# Altium schematic sheet Title-Page.SchDoc
size A4; SheetNumber: 1; SheetTotal: 9
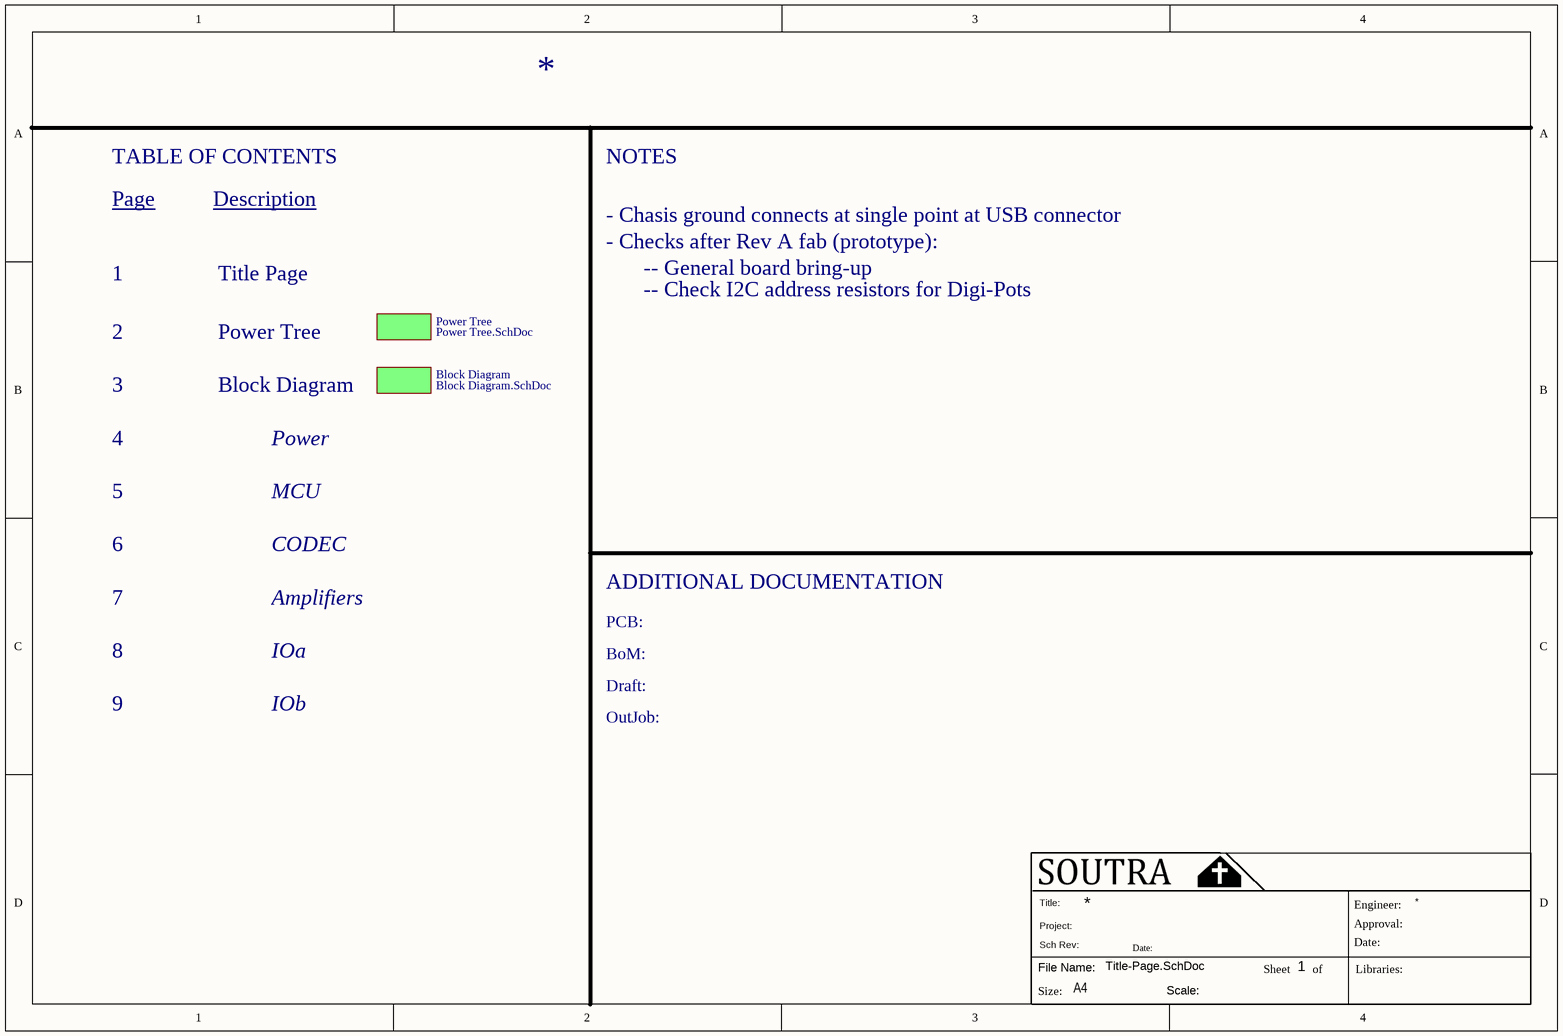
[diagram p0: Title-Page.SchDoc]

## Sub-sheets
Block Diagram = Block Diagram.SchDoc: no entries
Power Tree = Power Tree.SchDoc: no entries

## Notes on the sheet
- TABLE OF CONTENTS
- NOTES
- Page
- Description
- - Chasis ground connects at single point at USB connector
- 1
- Title Page
- - Checks after Rev A fab (prototype):
- -- General board bring-up
- -- Check I2C address resistors for Digi-Pots
- 2
- Power Tree
- 3
- 4
- Block Diagram
- Power
- 5
- MCU
- 6
- CODEC
- 7
- Amplifiers
- ADDITIONAL DOCUMENTATION
- PCB:
- 8
- 9
- IOa
- IOb
- BoM:
- Draft:
- OutJob:
- Title:
- Engineer:
- File Name:
- Size:
- Project:
- Sch Rev:
- Date:
- Scale:
- Sheet
- of
- Approval:
- Libraries:
- A4